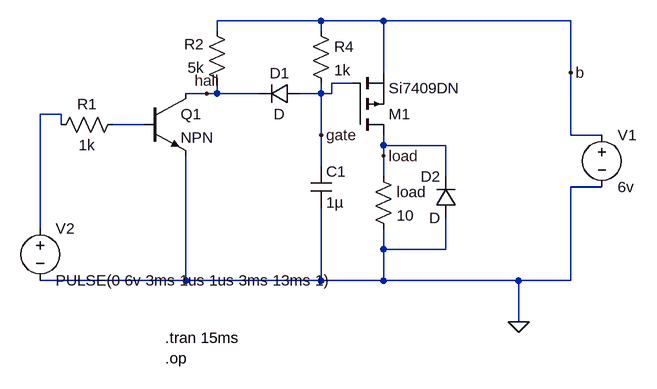
[diagram p0: schematic brushless.asc]
brushless.asc, the LTspice schematic file:
Version 4
SHEET 1 880 704
WIRE 64 160 -96 160
WIRE 160 160 64 160
WIRE 448 160 160 160
WIRE -96 176 -96 160
WIRE 64 176 64 160
WIRE 160 240 160 160
WIRE 448 240 448 160
WIRE 112 256 80 256
WIRE -112 272 -144 272
WIRE -96 272 -96 256
WIRE -96 272 -112 272
WIRE -32 272 -96 272
WIRE 64 272 64 256
WIRE 64 272 32 272
WIRE 80 272 80 256
WIRE 80 272 64 272
WIRE -336 304 -368 304
WIRE -336 320 -336 304
WIRE -208 320 -256 320
WIRE 64 336 64 272
WIRE 448 336 448 240
WIRE 496 336 448 336
WIRE 160 352 160 336
WIRE 256 352 160 352
WIRE 160 368 160 352
WIRE 64 384 64 336
WIRE 160 400 160 368
WIRE 256 400 256 352
WIRE 496 416 448 416
WIRE -368 480 -368 304
WIRE 160 512 160 480
WIRE 256 512 256 464
WIRE 256 512 160 512
WIRE -144 560 -144 368
WIRE -144 560 -368 560
WIRE 64 560 64 448
WIRE 64 560 -144 560
WIRE 160 560 160 512
WIRE 160 560 64 560
WIRE 368 560 160 560
WIRE 448 560 448 416
WIRE 448 560 368 560
WIRE 368 624 368 560
FLAG 368 624 0
FLAG 448 240 b
FLAG 64 336 gate
FLAG 160 368 load
FLAG -112 272 hall
SYMBOL voltage 496 320 R0
SYMATTR InstName V1
SYMATTR Value 6v
SYMBOL res 144 384 R0
SYMATTR InstName load
SYMATTR Value 10
SYMBOL voltage -368 464 R0
SYMATTR InstName V2
SYMATTR Value PULSE(0 6v 3ms 1us 1us 3ms 13ms 1)
SYMBOL pmos 112 336 M180
SYMATTR InstName M1
SYMATTR Value Si7409DN
SYMBOL npn -208 272 R0
SYMATTR InstName Q1
SYMBOL res -240 304 R90
WINDOW 0 0 56 VBottom 2
WINDOW 3 32 56 VTop 2
SYMATTR InstName R1
SYMATTR Value 1k
SYMBOL res -80 272 R180
WINDOW 0 36 76 Left 2
WINDOW 3 36 40 Left 2
SYMATTR InstName R2
SYMATTR Value 5k
SYMBOL diode 32 256 R90
WINDOW 0 0 32 VBottom 2
WINDOW 3 32 32 VTop 2
SYMATTR InstName D1
SYMBOL res 48 160 R0
SYMATTR InstName R4
SYMATTR Value 1k
SYMBOL cap 48 384 R0
SYMATTR InstName C1
SYMATTR Value 1µ
SYMBOL diode 272 464 R180
WINDOW 0 24 64 Left 2
WINDOW 3 24 0 Left 2
SYMATTR InstName D2
TEXT -176 680 Left 2 !.op
TEXT -176 648 Left 2 !.tran 15ms

The netlist it stands for:
* brushless.asc
V1 b 0 6v
R§load load 0 10
V2 N001 0 PULSE(0 6v 3ms 1us 1us 3ms 13ms 1)
M1 load gate b b Si7409DN
Q1 hall N002 0 0 NPN
R1 N002 N001 1k
R2 hall b 5k
D1 gate hall D
R4 b gate 1k
C1 gate 0 1µ
D2 0 load D
.model D D
.lib standard.dio
.model NPN NPN
.model PNP PNP
.lib standard.bjt
.model NMOS NMOS
.model PMOS PMOS
.lib standard.mos
.op
.tran 15ms
.backanno
.end